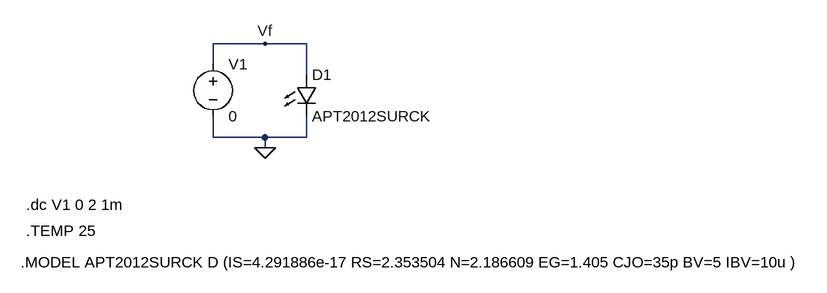
[diagram p0: schematic LED_test.asc]
LED_test.asc, the LTspice schematic file:
Version 4
SHEET 1 880 680
WIRE 48 48 -32 48
WIRE 112 48 48 48
WIRE -32 80 -32 48
WIRE 112 96 112 48
WIRE -32 192 -32 160
WIRE 48 192 -32 192
WIRE 112 192 112 160
WIRE 112 192 48 192
WIRE 48 208 48 192
FLAG 48 208 0
FLAG 48 48 Vf
SYMBOL LED 96 96 R0
SYMATTR InstName D1
SYMATTR Value APT2012SURCK
SYMBOL voltage -32 64 R0
SYMATTR InstName V1
SYMATTR Value 0
TEXT -328 384 Left 2 !.MODEL APT2012SURCK D (IS=4.291886e-17 RS=2.353504 N=2.186609 EG=1.405 CJO=35p BV=5 IBV=10u )
TEXT -320 336 Left 2 !.TEMP 25
TEXT -320 296 Left 2 !.dc V1 0 2 1m

The netlist it stands for:
* LED_test.asc
D1 Vf 0 APT2012SURCK
V1 Vf 0 0
.model D D
.lib standard.dio
.MODEL APT2012SURCK D (IS=4.291886e-17 RS=2.353504 N=2.186609 EG=1.405 CJO=35p BV=5 IBV=10u )
.TEMP 25
.dc V1 0 2 1m
.backanno
.end